# EAGLE design main (EAGLE 7.2.0)
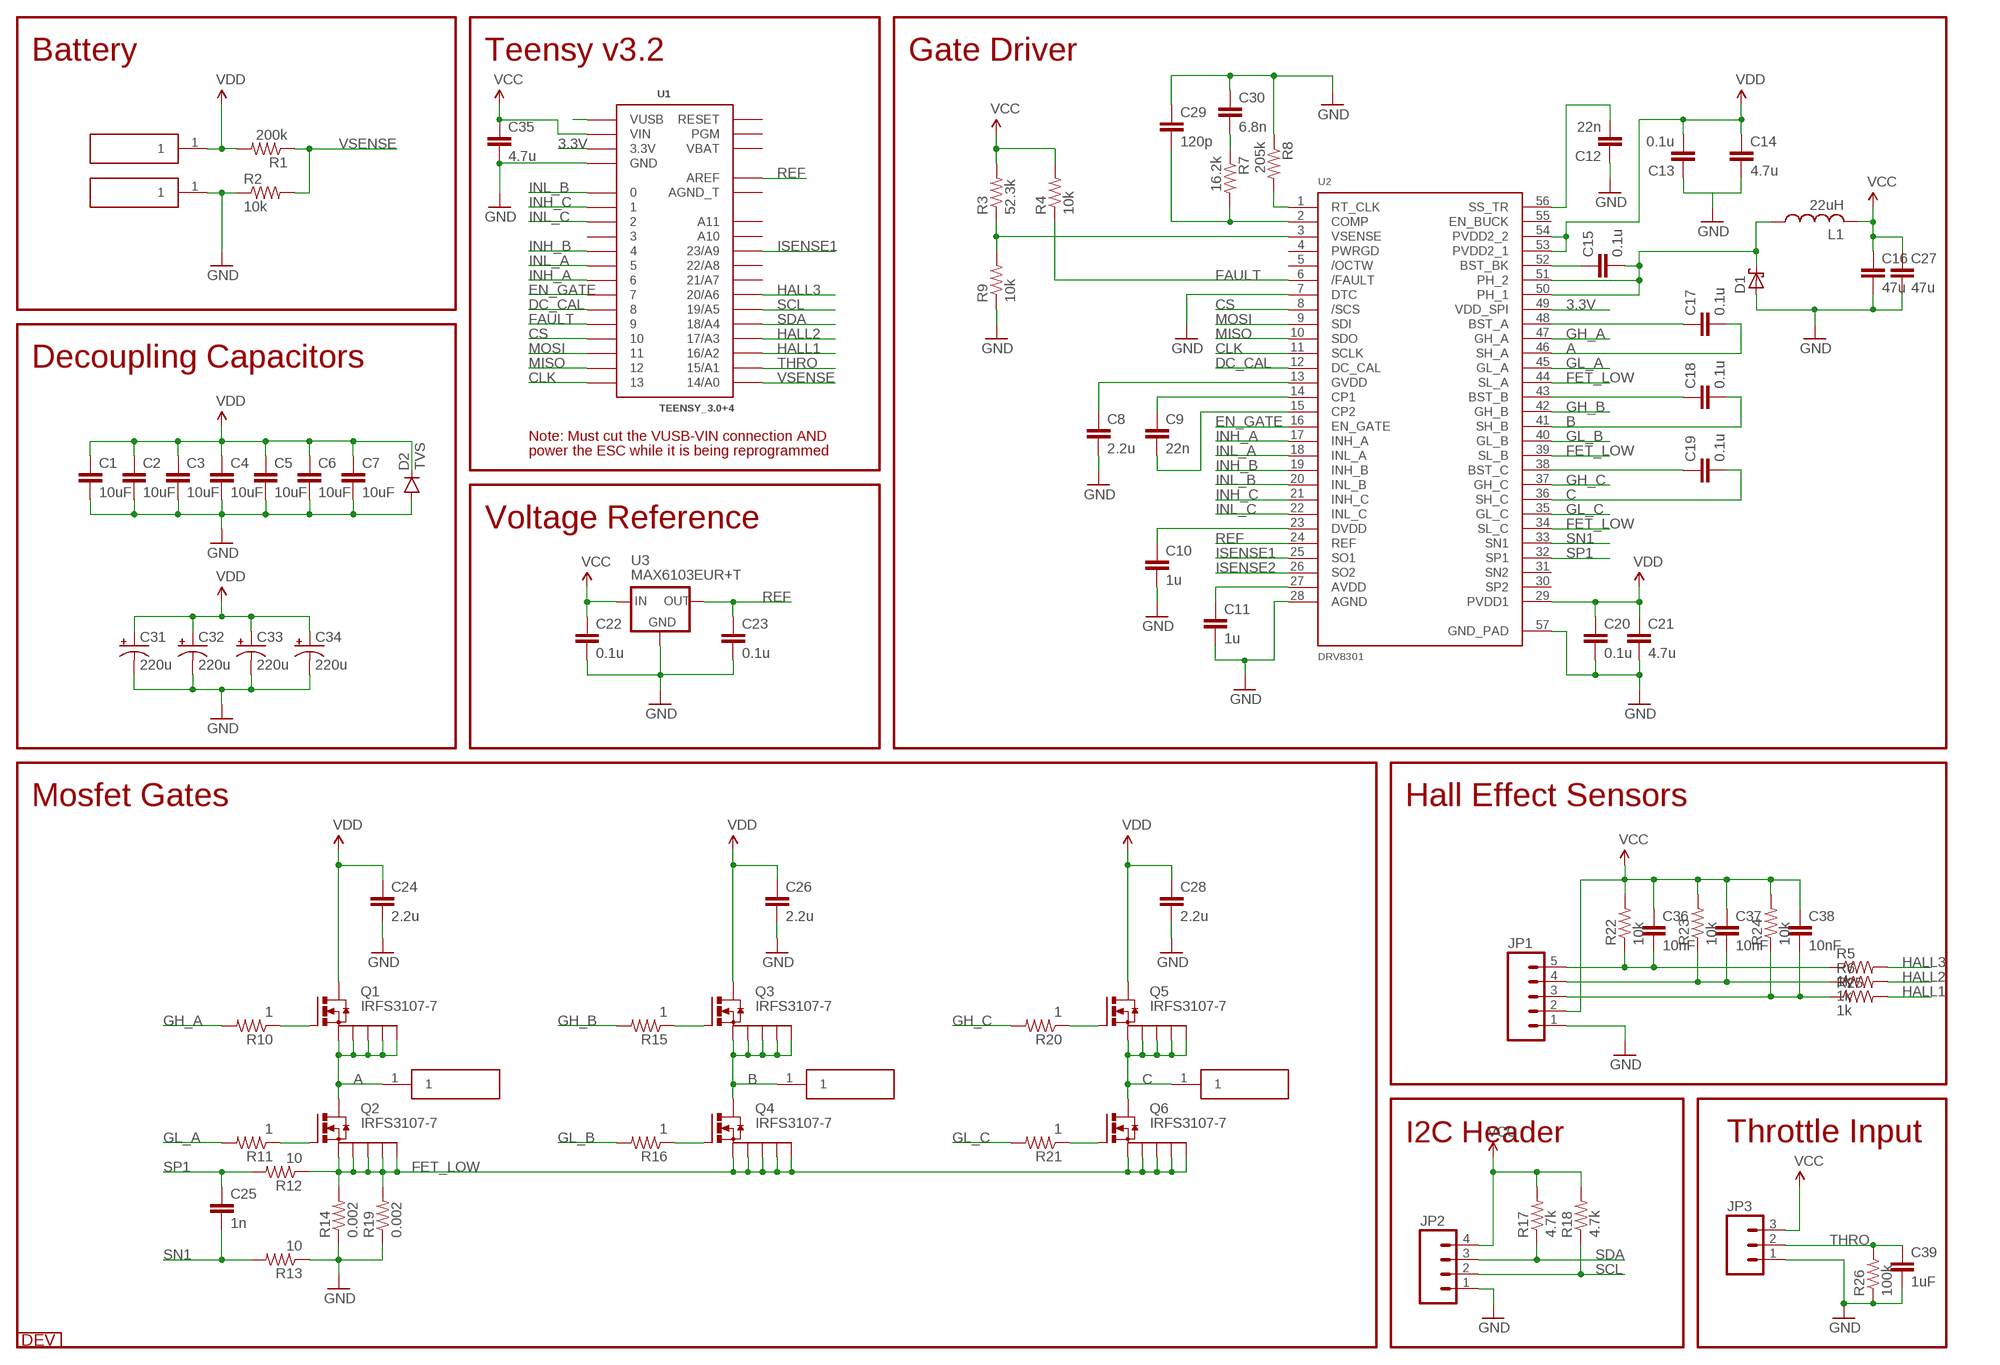
[diagram p0: schematic, sheet 1]

## Parts
C1  10uF  CAP1206  [1206]
C2  10uF  CAP1206  [1206]
C3  10uF  CAP1206  [1206]
C4  10uF  CAP1206  [1206]
C5  10uF  CAP1206  [1206]
C6  10uF  CAP1206  [1206]
C7  10uF  CAP1206  [1206]
C8  2.2u  CAP0603-CAP  [0603-CAP]
C9  22n  CAP0603-CAP  [0603-CAP]
C10  1u  CAP0603-CAP  [0603-CAP]
C11  1u  CAP0603-CAP  [0603-CAP]
C12  22n  CAP0603-CAP  [0603-CAP]
C13  0.1u  CAP0603-CAP  [0603-CAP]
C14  4.7u  CAP0805  [0805]
C15  0.1u  CAP0603-CAP  [0603-CAP]
C16  47u  CAP0805  [0805]
C17  0.1u  CAP0603-CAP  [0603-CAP]
C18  0.1u  CAP0603-CAP  [0603-CAP]
C19  0.1u  CAP0603-CAP  [0603-CAP]
C20  0.1u  CAP0603-CAP  [0603-CAP]
C21  4.7u  CAP0805  [0805]
C22  0.1u  CAP0603-CAP  [0603-CAP]
C23  0.1u  CAP0603-CAP  [0603-CAP]
C24  2.2u  CAP1206  [1206]
C25  1n  CAP0603-CAP  [0603-CAP]
C26  2.2u  CAP1206  [1206]
C27  47u  CAP0805  [0805]
C28  2.2u  CAP1206  [1206]
C29  120p  CAP0603-CAP  [0603-CAP]
C30  6.8n  CAP0603-CAP  [0603-CAP]
C31  220u  CPOL-USE3.5-8  [E3,5-8]
C32  220u  CPOL-USE3.5-8  [E3,5-8]
C33  220u  CPOL-USE3.5-8  [E3,5-8]
C34  220u  CPOL-USE3.5-8  [E3,5-8]
C35  4.7u  CAP0603-CAP  [0603-CAP]
C36  10nF  CAP0603-CAP  [0603-CAP]
C37  10nF  CAP0603-CAP  [0603-CAP]
C38  10nF  CAP0603-CAP  [0603-CAP]
C39  1uF  CAP0603-CAP  [0603-CAP]
D1  SCHOTTKY_SMA  [SMA]
D2  TVS  DIODEES3J  [SMC]
J1  0.125_PAD  [0.125_PAD]
J2  0.125_PAD  [0.125_PAD]
J3  0.125_PAD  [0.125_PAD]
J4  0.125_PAD  [0.125_PAD]
J5  0.125_PAD  [0.125_PAD]
JP1  M05PTH  [1X05]
JP2  M04PTH  [1X04]
JP3  M03PTH  [1X03]
L1  22uH  L-USL5650M  [L5650M]
Q1  IRFS3107-7  [D2PAK-7]
Q2  IRFS3107-7  [D2PAK-7]
Q3  IRFS3107-7  [D2PAK-7]
Q4  IRFS3107-7  [D2PAK-7]
Q5  IRFS3107-7  [D2PAK-7]
Q6  IRFS3107-7  [D2PAK-7]
R1  200k  RESISTOR0603  [0603-RES]
R2  10k  RESISTOR0603  [0603-RES]
R3  52.3k  RESISTOR0603  [0603-RES]
R4  10k  RESISTOR0603  [0603-RES]
R5  1k  RESISTOR0603-RES  [0603-RES]
R6  1k  RESISTOR0603-RES  [0603-RES]
R7  16.2k  RESISTOR0603  [0603-RES]
R8  205k  RESISTOR0603  [0603-RES]
R9  10k  RESISTOR0603  [0603-RES]
R10  1  RESISTOR0603  [0603-RES]
R11  1  RESISTOR0603  [0603-RES]
R12  10  RESISTOR0603  [0603-RES]
R13  10  RESISTOR0603  [0603-RES]
R14  0.002  RESISTOR2512  [R2512]
R15  1  RESISTOR0603  [0603-RES]
R16  1  RESISTOR0603  [0603-RES]
R17  4.7k  RESISTOR0603-RES  [0603-RES]
R18  4.7k  RESISTOR0603-RES  [0603-RES]
R19  0.002  RESISTOR2512  [R2512]
R20  1  RESISTOR0603  [0603-RES]
R21  1  RESISTOR0603  [0603-RES]
R22  10k  RESISTOR0603  [0603-RES]
R23  10k  RESISTOR0603  [0603-RES]
R24  10k  RESISTOR0603  [0603-RES]
R25  1k  RESISTOR0603-RES  [0603-RES]
R26  100k  RESISTOR0603-RES  [0603-RES]
U1  TEENSY_3.0+4  [TEENSY_3.0+4]
U2  DRV8301  [DRV8301]
U3  MAX6103EUR+T  [SOT23-3]
U$16  DEV  [DEV]

## Nets
3.3V: U1.3.3V U1.3.3V1(3.3V) U2.49(VDD_SPI)
A: C17.2 J3.1 Q1.S Q1.S1 Q1.S2 Q1.S3 Q1.S4 Q2.D U2.46(SH_A)
B: C18.2 J4.1 Q3.S Q3.S1 Q3.S2 Q3.S3 Q3.S4 Q4.D U2.41(SH_B)
C: C19.2 J5.1 Q5.S Q5.S1 Q5.S2 Q5.S3 Q5.S4 Q6.D U2.36(SH_C)
CLK: U1.13 U2.11(SCLK)
CS: U1.10 U2.8(/SCS)
DC_CAL: U1.8 U2.12(DC_CAL)
EN_GATE: U1.7 U2.16(EN_GATE)
FAULT: R4.1 U1.9 U2.6(/FAULT)
FET_LOW: Q2.S Q2.S1 Q2.S2 Q2.S3 Q2.S4 Q4.S Q4.S1 Q4.S2 Q4.S3 Q4.S4 Q6.S Q6.S1 Q6.S2 Q6.S3 Q6.S4 R12.1 R14.2 R19.2 U2.34(SL_C) U2.39(SL_B) U2.44(SL_A)
GH_A: R10.2 U2.47(GH_A)
GH_B: R15.2 U2.42(GH_B)
GH_C: R20.2 U2.37(GH_C)
GL_A: R11.2 U2.45(GL_A)
GL_A': Q2.G R11.1
GL_B: R16.2 U2.40(GL_B)
GL_B': Q4.G R16.1
GL_C: R21.2 U2.35(GL_C)
GL_C': Q6.G R21.1
GND: C1.2 C2.2 C3.2 C4.2 C5.2 C6.2 C7.2 C8.2 C10.2 C11.2 C12.1 C13.1 C14.2 C16.2 C20.2 C21.2 C22.2 C23.2 C24.2 C26.2 C27.2 C28.2 C29.1 C30.1 C31.- C32.- C33.- C34.- C35.2 C39.2 D1.A D2.A J2.1 JP1.1 JP2.1 JP3.1 R2.1 R8.1 R9.1 R13.1 R14.1 R19.1 R26.1 U1.GND U1.GND1(GND) U2.7(DTC) U2.28(AGND) U2.57(GND_PAD) U3.3(GND)
HALL1: R25.2 U1.16/A2
HALL2: R6.2 U1.17/A3
HALL3: R5.2 U1.20/A6
INH_A: U1.6 U2.17(INH_A)
INH_B: U1.4 U2.19(INH_B)
INH_C: U1.1 U2.21(INH_C)
INL_A: U1.5 U2.18(INL_A)
INL_B: U1.0 U2.20(INL_B)
INL_C: U1.2 U2.22(INL_C)
ISENSE1: U1.23/A9 U2.25(SO1)
ISENSE2: U2.26(SO2)
MISO: U1.12 U2.10(SDO)
MOSI: U1.11 U2.9(SDI)
N$1: Q3.G R15.1
N$2: R3.1 R9.2 U2.3(VSENSE)
N$3: C29.2 R7.2 U2.2(COMP)
N$4: C10.1 U2.23(DVDD)
N$5: Q5.G R20.1
N$6: C12.2 U2.56(SS_TR)
N$7: C30.2 R7.1
N$8: C15.1 U2.52(BST_BK)
N$9: Q1.G R10.1
N$10: R8.2 U2.1(RT_CLK)
N$12: U1.VUSB
N$13: C36.2 JP1.5 R5.1 R22.1
N$14: C37.2 JP1.4 R6.1 R23.1
N$15: C38.2 JP1.3 R24.1 R25.1
N$28: C19.1 U2.38(BST_C)
N$30: C9.1 U2.14(CP1)
N$31: C11.1 U2.27(AVDD)
N$32: C9.2 U2.15(CP2)
N$33: C8.1 U2.13(GVDD)
N$34: C18.1 U2.43(BST_B)
N$44: C17.1 U2.48(BST_A)
N$47: C15.2 D1.C L1.1 U2.50(PH_1) U2.51(PH_2)
REF: C23.1 U1.AREF U2.24(REF) U3.2(OUT)
SCL: JP2.2 R18.1 U1.19/A5
SDA: JP2.3 R17.1 U1.18/A4
SN1: C25.2 R13.2 U2.33(SN1)
SP1: C25.1 R12.2 U2.32(SP1)
THRO: C39.1 JP3.2 R26.2 U1.15/A1
VCC: C16.1 C22.1 C27.1 C35.1 C36.1 C37.1 C38.1 JP1.2 JP2.4 JP3.3 L1.2 R3.2 R4.2 R17.2 R18.2 R22.2 R23.2 R24.2 U1.VIN U3.1(IN)
VDD: C1.1 C2.1 C3.1 C4.1 C5.1 C6.1 C7.1 C13.2 C14.1 C20.1 C21.1 C24.1 C26.1 C28.1 C31.+ C32.+ C33.+ C34.+ D2.C J1.1 Q1.D Q3.D Q5.D R1.2 U2.29(PVDD1) U2.53(PVDD2_1) U2.54(PVDD2_2)
VSENSE: R1.1 R2.2 U1.14/A0
Unconnected: U1.3 U1.21/A7 U1.22/A8 U1.A10 U1.A11 U1.PGM U1.RESET U2.4(PWRGD) U2.5(/OCTW) U2.30(SP2) U2.31(SN2) U2.55(EN_BUCK)

## Notes on the sheet
- Battery | Teensy v3.2 | Gate Driver
- Decoupling Capacitors
- Note: Must cut the VUSB-VIN connection AND
- power the ESC while it is being reprogrammed
- Voltage Reference
- Mosfet Gates | Hall Effect Sensors
- I2C Header | Throttle Input

## Power pins joined to a net without a drawn wire
AGND_T: U1.AGND_T
VBAT: U1.VBAT

## Library data of the parts
C1-C30 C35 = SparkFun-Capacitors:CAP: Capacitor Standard 0603 ceramic capacitor, and 0.1" leaded capacitor.
C31-C34 = rcl:CPOL-US: POLARIZED CAPACITOR, American symbol
C36-C39 = SparkFun-Passives:CAP: Capacitor Standard 0603 ceramic capacitor, and 0.1" leaded capacitor.
D1 = sc_usercreated:SCHOTTKY_SMA
D2 = SparkFun-DiscreteSemi:DIODE: Diode These are standard reverse protection diodes and small signal diodes. SMA package can handle up to about 1A. SOD-323 can handle about 200mA. What the SOD-323 package when ordering, there are some mfgs out there that are 5-pin packages.; PROD_ID: DIO-12441; VALUE: 3A/600V
J1-J5 = sc_usercreated:0.125_PAD
JP1 = SparkFun-Connectors:M05: Header 5 Standard 5-pin 0.1" header. Use with straight break away headers (SKU : PRT-00116), right angle break away headers (PRT-00553), swiss pins (PRT-00743), machine pins (PRT-00117), and female headers (PRT-00115). Molex polarized connector foot print use with SKU : PRT-08230 with associated crimp pins and housings.
JP2 = SparkFun-Connectors:M04: Header 4 Standard 4-pin 0.1" header. Use with straight break away headers (SKU : PRT-00116), right angle break away headers (PRT-00553), swiss pins (PRT-00743), machine pins (PRT-00117), and female headers (PRT-00115). Molex polarized connector foot print use with SKU : PRT-08231 with associated crimp pins and housings. 1MM SMD Version SKU: PRT-10208
JP3 = SparkFun-Connectors:M03: Header 3 Standard 3-pin 0.1" header. Use with straight break away headers (SKU : PRT-00116), right angle break away headers (PRT-00553), swiss pins (PRT-00743), machine pins (PRT-00117), and female headers (PRT-00115). Molex polarized connector foot print use with SKU : PRT-08232 with associated crimp pins and housings.
L1 = rcl:L-US: INDUCTOR, American symbol
Q1-Q6 = sc_usercreated:IRFS3107-7
R1-R4 R7-R16 R19-R24 = SparkFun-Resistors:RESISTOR: Resistor Basic schematic elements and footprints for 0603, 1206, and PTH resistors.
R5 R6 R17 R18 R25 R26 = SparkFun-Passives:RESISTOR: Resistor Basic schematic elements and footprints for 0603, 1206, and PTH resistors.
U1 = Teensy3.0:TEENSY_3.0+4: Teensy 3.0 board, showing all pins that are easily acessible. See 'AllAnalogPins" and 'AllPins' packages for additional pin holes, as needed. The 'Basic' package has fewer pins.
U2 = F-J:DRV8301
U3 = F-J:MAX6103EUR+T
U$16 = F-J:DEV

## Board
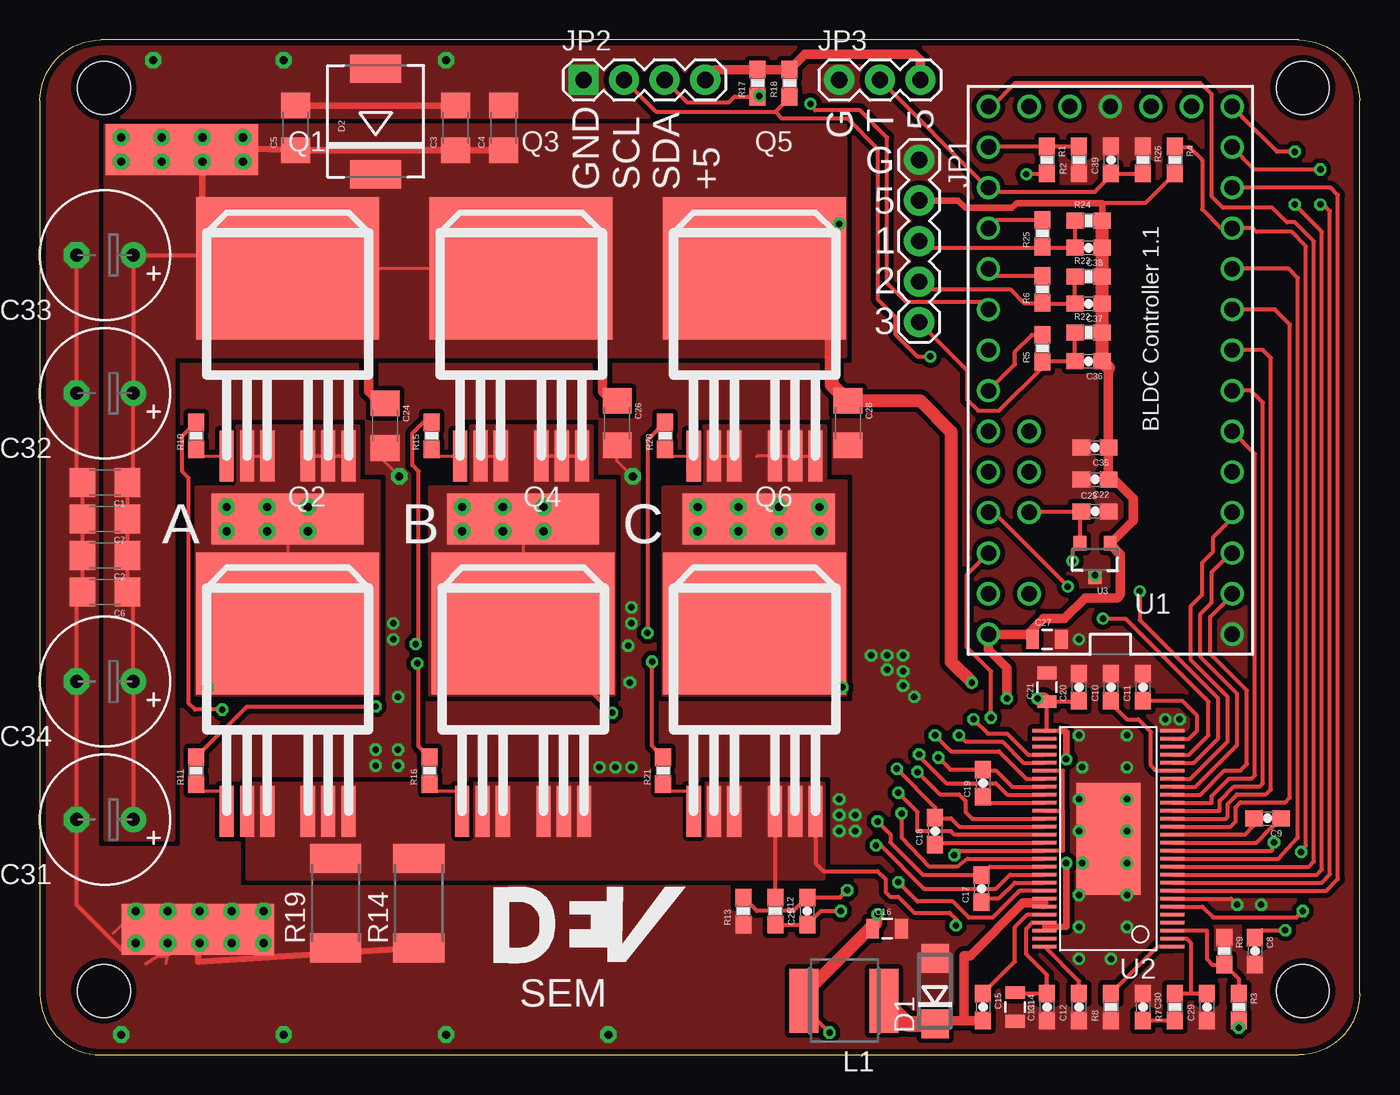
[diagram p1: board, top side]
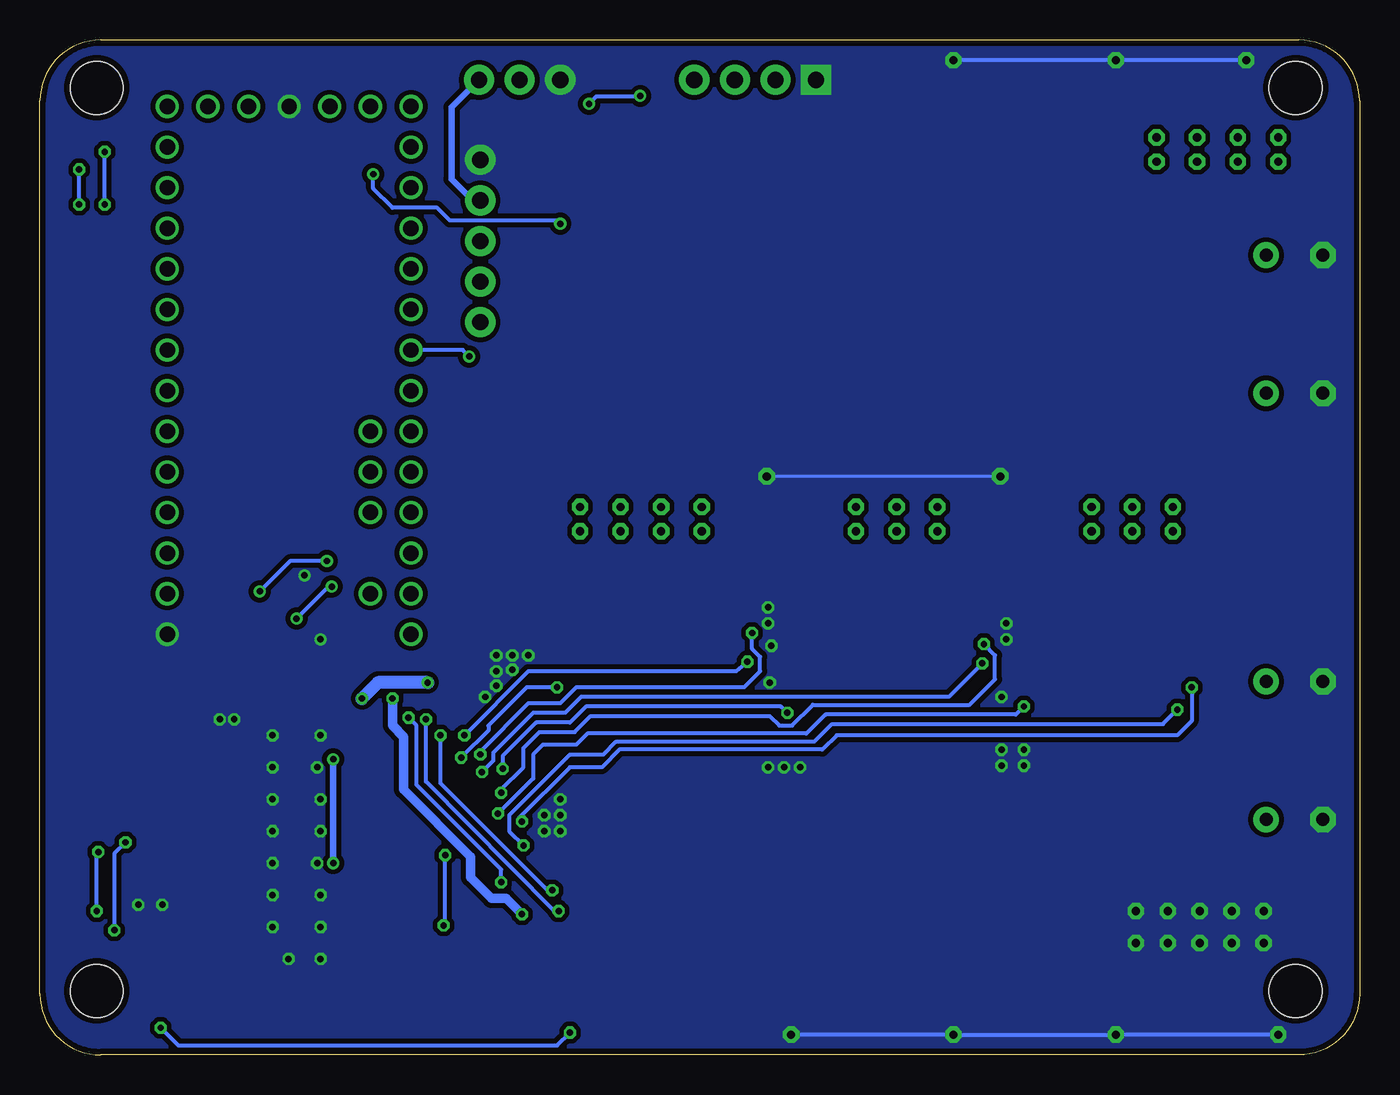
[diagram p2: board, bottom side, seen from below]

Size 82.55 x 63.5 mm. Coordinates in mm from the lower left corner, seen from the top.
Outline: 82.55,3.81 82.55,59.69 arc90 78.74,63.5 3.81,63.5 arc90 0,59.69 0,3.81 arc90 3.81,0 78.74,0 arc90 82.55,3.81
Copper layers (1*16): Top 0.0356mm / dielectric 1.5011mm / Bottom 0.0356mm
Design rules "patrick": minimum track width 6mil, minimum drill 13mil, track to track 6mil, track to pad 6mil, pad to pad 6mil, via to via 6mil, smd to smd 6mil, copper to edge 15mil, drill to drill 6mil, minimum pad ring 7mil, minimum via ring 7mil, stop-mask expansion 3mil, vias tented up to drill 30mil, thermal gap 10mil
Holes 3.3 mm at 4,60.5 79,60.5 4,4 79,4

### Footprints (pad centres in the part's own frame; a part is rotated, then mirrored left to right if it is on the bottom)
1206 = smd 1.6 x 1.8: 1 -1.4,0; 2 1.4,0
0603-CAP = smd 1.1 x 1: 1 -0.85,0; 2 0.85,0
0805 = smd 0.8 x 1.2: 1 -0.9,0; 2 0.9,0
E3,5-8 = drill 0.813 pad 1.6: + -1.778,0 | drill 0.813 pad 1.6 octagon: - 1.778,0
SMA = smd 1.8 x 1.7: A 2.05,0; C -2.05,0
SMC = smd 1.778 x 3.175: A 3.302,0; C -3.302,0
0.125_PAD = smd 9.525 x 3.175: 1 0,0
1X05 = drill 1.016 pad 1.88: 1 0,0; 2 2.54,0; 3 5.08,0; 4 7.62,0; 5 10.16,0
1X04 = drill 1.016 pad 1.88 square: 1 0,0 | drill 1.016 pad 1.88: 2 2.54,0; 3 5.08,0; 4 7.62,0
1X03 = drill 1.016 pad 1.88: 1 0,0; 2 2.54,0; 3 5.08,0
L5650M = smd 1.8 x 4: 1 -2.5,0; 2 2.5,0
D2PAK-7 = smd 11.43 x 8.89: D 0,11.748 | smd 0.889 x 3.175: G -3.81,0; S -2.54,0; S1 -1.27,0; S2 1.27,0; S3 2.54,0; S4 3.81,0
0603-RES = smd 1.1 x 1: 1 -0.85,0; 2 0.85,0
R2512 = smd 1.8 x 3.2: 1 -2.8,0; 2 2.8,0
TEENSY_3.0+4 = drill 0.965: 0 -7.62,13.97; 1 -7.62,11.43; 2 -7.62,8.89; 3 -7.62,6.35; 3.3V 7.62,11.43; 3.3V1 -2.54,-16.51; 4 -7.62,3.81; 5 -7.62,1.27; 6 -7.62,-1.27; 7 -7.62,-3.81; 8 -7.62,-6.35; 9 -7.62,-8.89; 10 -7.62,-11.43; 11 -7.62,-13.97; 12 -7.62,-16.51; 13 7.62,-16.51; 14/A0 7.62,-13.97; 15/A1 7.62,-11.43; 16/A2 7.62,-8.89; 17/A3 7.62,-6.35; 18/A4 7.62,-3.81; 19/A5 7.62,-1.27; 20/A6 7.62,1.27; 21/A7 7.62,3.81; 22/A8 7.62,6.35; 23/A9 7.62,8.89; A10 5.08,6.35; A11 5.08,3.81; AGND_T 7.62,13.97; AREF 5.08,8.89; GND -7.62,16.51; GND1 0,-16.51; PGM 2.54,-16.51; RESET 5.08,-16.51; VBAT -5.08,-16.51; VIN 7.62,16.51; VUSB 5.08,13.97
DRV8301 = smd 1.5 x 0.21: 1 -4,6.75; 2 -4,6.25; 3 -4,5.75; 4 -4,5.25; 5 -4,4.75; 6 -4,4.25; 7 -4,3.75; 8 -4,3.25; 9 -4,2.75; 10 -4,2.25; 11 -4,1.75; 12 -4,1.25; 13 -4,0.75; 14 -4,0.25; 15 -4,-0.25; 16 -4,-0.75; 17 -4,-1.25; 18 -4,-1.75; 19 -4,-2.25; 20 -4,-2.75; 21 -4,-3.25; 22 -4,-3.75; 23 -4,-4.25; 24 -4,-4.75; 25 -4,-5.25; 26 -4,-5.75; 27 -4,-6.25; 28 -4,-6.75; 29 4,-6.75; 30 4,-6.25; 31 4,-5.75; 32 4,-5.25; 33 4,-4.75; 34 4,-4.25; 35 4,-3.75; 36 4,-3.25; 37 4,-2.75; 38 4,-2.25; 39 4,-1.75; 40 4,-1.25; 41 4,-0.75; 42 4,-0.25; 43 4,0.25; 44 4,0.75; 45 4,1.25; 46 4,1.75; 47 4,2.25; 48 4,2.75; 49 4,3.25; 50 4,3.75; 51 4,4.25; 52 4,4.75; 53 4,5.25; 54 4,5.75; 55 4,6.25; 56 4,6.75 | smd 4 x 7: 57 0,0
SOT23-3 = smd 0.8 x 0.9: 1 -0.95,-1; 2 0.95,-1; 3 0,1.1

### Placement (x,y rotation side)
C1  4.06,35.81 180 top
C2  4.06,31.24 180 top
C3  26,58 90 top
C4  29,58 90 top
C5  16,58 90 top
C6  4.06,28.96 180 top
C7  4.06,33.53 180 top
C8  76,6.5 270 top
C9  76.8,14.8 180 top
C10  67,23 90 top
C11  69,23 90 top
C12  65,3 90 top
C13  63,3 90 top
C14  61,3 270 top
C15  59,3 270 top
C16  53,7.9 0 top
C17  58.9,10.4 90 top
C18  56,14 90 top
C19  59,17 90 top
C20  65,23 90 top
C21  63,23 90 top
C22  66,36 180 top
C23  66,34 0 top
C24  21.59,39.37 270 top
C25  48,9 90 top
C26  36.11,39.53 270 top
C27  63,26 0 top
C28  50.55,39.53 270 top
C29  73,3 90 top
C30  69,3 270 top
C31  4.06,14.73 180 top
C32  4.06,41.4 180 top
C33  4.06,50.04 180 top
C34  4.06,23.37 180 top
C35  66,38 180 top
C36  65.6,43.4 180 top
C37  65.6,47 180 top
C38  65.6,50.5 180 top
C39  67,56 90 top
D1  56,4 90 top
D2  21,58.4 90 top
J1  8.89,56.64 0 top
J2  9.89,7.86 0 top
J3  15.49,33.53 0 top
J4  30.23,33.53 0 top
J5  44.96,33.53 0 top
JP1  55,56 270 top
JP2  34,61 0 top
JP3  50,61 0 top
L1  50.3,3.4 180 top
Q1  15.49,37.47 0 top
Q2  15.49,15.24 0 top
Q3  30.1,37.47 0 top
Q4  30.23,15.24 0 top
Q5  44.7,37.47 0 top
Q6  44.7,15.24 0 top
R1  63,56 270 top
R2  65,56 90 top
R3  75,3 270 top
R4  71,56 270 top
R5  62.7,44.2 90 top
R6  62.7,47.9 90 top
R7  71,3 90 top
R8  67,3 90 top
R9  74.1,6.5 270 top
R10  9.78,38.73 90 top
R11  9.78,17.78 90 top
R12  46,9 270 top
R13  44,9 90 top
R14  23.7,9.5 90 top
R15  24.51,38.73 90 top
R16  24.38,17.78 90 top
R17  44.9,60.8 90 top
R18  46.9,60.8 90 top
R19  18.5,9.5 90 top
R20  39.12,38.73 90 top
R21  38.99,17.78 90 top
R22  65.6,45.2 0 top
R23  65.6,48.7 0 top
R24  65.6,52.2 0 top
R25  62.7,51.4 90 top
R26  69,56 270 top
U1  66.96,42.83 180 top
U2  66.83,13.53 180 top
U3  66,31 180 top
U$16  28.4,5.77 0 top

### Tracks (layer width: path | path; a pad name or v marks a point on that pad's centre or on a via)
3.3V  (via drill 0.4)
  Top 0.254: U2.49 61.28,10.28 59.6,8.6 58.1,8.6 57.1,9.6 54.9,9.6 v53.7,10.8 | v59.5,21.1 59.5,24 58,25.5 58,30.06 U1.3.3V
  Bottom 0.254: v53.7,10.8 53.7,11.6 59,16.9 59,20.6 v59.5,21.1
A  (via drill 0.4, 0.51 pad 1.02)
  Top 0.203: Q1.S Q1.S1 | J3.1 Q2.D | Q1.S2 Q1.S3 Q1.S4 Q1.S2
  Top 0.254: U2.46 59.43,11.78 C17.2 55.25,11.25 53.2,13.3 53.2,13.8 v52.4,14.6 | Q2.D 14.49,26.99 v10.5,23
  Bottom 0.254: v10.5,23 10.5,20.9 11.4,20 32.7,20 33.6,19.1 46.3,19.1 47.4,18 49.4,18 52.6,14.8 v52.4,14.6
  other vias: 11.68,34.29 11.68,32.77 14.22,34.29 14.22,32.77 16.76,34.29 16.76,32.77
  pour Top (no thermals): 9.78,22.48 9.78,35.56 12.32,35.56 12.32,39.37 19.94,39.37 19.94,35.94 21.21,35.94 21.21,22.48
B  (via drill 0.4, 0.51 pad 1.02)
  Top 0.203: Q3.S Q3.S1 | J4.1 Q4.D | Q3.S2 Q3.S3 Q3.S4 Q3.S2
  Top 0.254: Q4.D 35.8,21.41 v35.8,21.4 | v53.6,17.9 56,15.5 C18.2 56.05,14.8 57,14.8 57.52,14.28 U2.41
  Bottom 0.254: v35.8,21.4 36.2,21.8 48.4,21.8 49.4,20.8 51.5,20.8 53.6,18.7 v53.6,17.9
  other vias: 26.42,34.29 26.42,32.77 28.96,34.29 28.96,32.77 31.5,34.29 31.5,32.77
  pour Top (no thermals): 24.38,22.48 24.38,35.56 26.92,35.56 26.92,39.37 34.54,39.37 34.54,35.94 35.94,35.94 35.94,22.48
C  (via drill 0.4, 0.51 pad 1.02)
  Top 0.203: Q5.S Q5.S1 | Q5.S4 Q5.S3 Q5.S2 44.83,37.47 | v48.77,32.77 v48.77,34.29
  Top 0.254: Q6.D 48.69,23 v50.2,23 | v56.2,18.6 56.95,17.85 C19.2 59.05,17.8 59.8,17.8 60.82,16.78 U2.36
  Bottom 0.254: v50.2,23 52.1,23 54.5,20.6 54.5,20.3 v56.2,18.6
  other vias: 41.15,34.29 41.15,32.77 43.69,32.77 43.69,34.29 46.23,34.29 46.23,32.77
  pour Top (no thermals): 38.99,22.48 38.99,35.56 41.53,35.56 41.53,39.37 49.15,39.37 49.15,35.94 50.42,35.94 50.42,22.48
CLK
  Top 0.254: U2.11 79.38,11.78 79.7,12.1 79.7,50.9 78.5,52.1 78,52.1 77.1,53 74,53 73.3,53.7 73.3,60.1 72.6,60.8 61,60.8 59.54,59.34 U1.13
CS
  Top 0.254: U2.8 80.48,10.28 81.2,11 81.2,53.8 80.74,54.26 U1.10
DC_CAL
  Top 0.254: U2.12 77.48,12.28 78.7,13.6 78.7,48.6 78.12,49.18 U1.8
EN_GATE
  Top 0.254: U1.7 77.26,46.64 78.2,45.7 78.2,16.1 77.9,15.8 75.1,15.8 74.8,15.5 74.8,14.6 74.48,14.28 U2.16
FAULT  (via drill 0.4)
  Top 0.254: v78.9,12.7 79.2,13.1 79.2,50.6 78.3,51.5 76.1,51.5 75.88,51.72 U1.9 73.88,51.72 72.7,52.9 72.7,56 71.9,56.8 71.05,56.8 R4.1 | U2.6 72.72,9.28 73.4,8.6 78.6,8.6 v79,9
  Bottom 0.254: v79,9 79,12.3 v78.9,12.7
FET_LOW  (via drill 0.4)
  Top 0.203: 19.3,13.97 Q2.S4
  Top 0.254: R12.1 46,15.21 Q6.S2 | 64,15.28 64,17.78 U2.34 | U2.39 64,15.28 | 64,15.28 64,12.78 U2.44 57.48,12.78 v57.2,12.5 | Q6.S4 48.51,12 49.01,11.5 52.4,11.5 52.9,11 52.9,10.2 53.2,9.9 53.7,9.9 54.7,8.9 56.9,8.9 57.3,8.5 v57.3,8.1
  Bottom 0.254: v57.3,8.1 57.2,8.2 v57.2,12.5
  pour Top (isolate 0.254, no thermals): 13,11 13,17 49,17 49,11
GH_A  (via drill 0.4)
  Top 0.254: v11.4,21.6 9.7,21.6 9.3,22 9.3,36.1 8.9,36.5 8.9,38.71 R10.2 | v52.3,13.1 52.6,13.1 55.3,10.4 59.8,10.4 60.68,11.28 U2.47
  Bottom 0.254: v11.4,21.6 12.3,20.7 33,20.7 34.1,19.6 46.5,19.6 47.3,18.8 49.4,18.8 53.2,15 53.2,14 v52.3,13.1
GH_B  (via drill 0.4)
  Top 0.254: U2.42 57.22,13.78 57,14 54.9,14 54.9,15.2 v53.7,16.4 | R15.2 23.98,39.59 23.3,38.9 23.3,36.9 23.7,36.5 23.7,25.9 v23.5,25.7
  Bottom 0.254: v53.7,16.4 53.7,16.6 52.3,18 52.3,19.2 51.3,20.2 49.1,20.2 48.1,21.2 36.9,21.2 36.3,20.6 35.5,20.6 34.2,21.9 24.4,21.9 22.8,23.5 22.8,25 v23.5,25.7
GH_C  (via drill 0.4)
  Top 0.254: R20.2 38,38.47 v38,26.4 | v55,18.8 55,18.7 56.7,17 59.8,17 60.52,16.28 U2.37
  Bottom 0.254: v55,18.8 55,19 52,22 50,22 49,23 38.5,23 37.5,24 37.5,24.9 38,25.4 v38,26.4
GL_A  (via drill 0.4)
  Top 0.254: R11.2 12.95,21.8 v21,21.8 | v53.9,15.1 53.9,13.6 55.6,11.8 57.44,11.8 58.02,12.28 U2.45
  Bottom 0.254: v21,21.8 21.5,21.3 33.4,21.3 34.6,20.1 48.3,20.1 49,19.4 51.1,19.4 51.7,18.8 51.7,17.3 v53.9,15.1
GL_A'
  Top 0.203: R11.1 9.56,16.51 11.68,16.51 Q2.G
GL_B  (via drill 0.4)
  Top 0.254: R16.2 23.7,19.31 23.7,24.4 v23.6,24.5 | v54.9,17.7 56.3,16.3 57.5,16.3 57.9,15.9 57.9,15.2 58.32,14.78 U2.40
  Bottom 0.254: v23.6,24.5 25.7,22.4 48.7,22.4 49.7,21.4 51.7,21.4 54.2,18.9 54.2,18.4 v54.9,17.7
GL_B'
  Top 0.203: R16.1 24.17,16.51 26.29,16.51 Q4.G
GL_C  (via drill 0.4)
  Top 0.254: R21.2 38.3,19.32 v38.3,24.6 | v56,20 57,19 60,19 61.72,17.28 U2.35
  Bottom 0.254: v38.3,24.6 39,24 52,24 v56,20
GL_C'
  Top 0.203: R21.1 38.77,16.51 40.89,16.51 Q6.G
GND  (via drill 0.4, 0.51 pad 1.02)
  Top 0.203: J2.1 7.97,6.18 | 7.97,6.18 7.87,5.71 | 6.6,5.71 7.15,6.04 | 7.15,6.04 J2.1 | 7.41,6.18 7.97,6.18 | 6.6,6.99 6.86,6.99 | 6.86,6.99 J2.1 | 9.02,6.35 J2.1 | 4.57,7.62 v6,9 | v6,9 v10,9 | v10,9 v12,9 | v14,7 v12,7 v10,7 7.29,6.1 arc45 7.15,6.04 | v6,7 5.08,6.6 v6,9 | v14,7 v14,9 | 12.7,6.35 v14,7 | v10,9 7.37,7.76 arc-45 7.18,7.31 6.86,6.99 | v22.48,36.2 21.59,37.08 C24.2 | v37.08,36.2 36.11,37.17 C26.2
  Top 0.254: 2.66,35.31 C7.2 C2.2 C6.2 2.29,28.58 C34.- C31.- 2.29,9.4 5.08,6.6 | 2.66,35.31 C1.2 2.29,36.19 C32.- C33.- | 2.29,35.68 2.66,35.31 | U2.7 74.52,9.78 v74.9,9.4
  Top 0.406: R14.1 9.91,5.84 J2.1 | C3.2 C5.2
  Bottom 0.203: v22.48,36.2 v37.08,36.2
  Bottom 0.254: v5.08,1.27 v15.24,1.27 v25.4,1.27 v35.56,1.27 | v7.08,62.23 v15.24,62.23 v25.4,62.23
  other vias: 76.4,9.4 71.3,21 70.4,21 67,6 65,6 65,8 68,8 65,10 68,10 68,12 65.2,12 65,14 65,16 68,14 68,16 68,18 65,20 65.2,18 68,20 22.1,27 22.1,26 22.4,22.4 22.4,19.1 21,19.1 21,18.1 22.4,18.1 35,18 36,18 37,18 36.9,23.3 36.8,25.6 37,27 37,28 52,25 53,25 54,25 54,24 53,24.1 54,23.1 54.7,22.4 50,16 50,15 50,14 51,15 51,14 8,9 8,7 66,30 65,26
  pour Bottom (isolate 0.305, rank 2, no thermals): 3.81,-5.08 78.74,-5.08 arc90 87.63,3.81 87.63,59.69 arc90 78.74,68.58 3.81,68.58 arc90 -5.08,59.69 -5.08,3.81 arc90
  pour Top (isolate 0.305, rank 2, no thermals): -2.54,3.81 arc90 3.81,-2.54 78.74,-2.54 arc90 85.09,3.81 85.09,59.69 arc90 78.74,66.04 3.81,66.04 arc90 -2.54,59.69
HALL1
  Top 0.254: U1.16/A2 59.87,52.25 R25.2
HALL2
  Top 0.254: U1.17/A3 59.77,48.75 R6.2
HALL3
  Top 0.254: U1.20/A6 61,43.22 61,44 62.05,45.05 R5.2
INH_A
  Top 0.254: U1.6 76.5,44.1 77,43.6 77,16.6 76.7,16.3 74.9,16.3 74.3,15.7 74.3,14.9 74.18,14.78 U2.17
INH_B
  Top 0.254: U1.4 76,37.6 76,17.5 75.8,17.3 74.4,17.3 73.3,16.2 73.3,15.8 73.28,15.78 U2.19
INH_C
  Top 0.254: U2.21 72.28,16.78 74.9,19.4 74.9,22.6 72.6,24.9 72.6,27.6 73.3,28.3 73.3,30.2 74.5,31.4 U1.1
INL_A
  Top 0.254: U1.5 75.74,41.56 76.5,40.8 76.5,17 76.3,16.8 74.7,16.8 73.8,15.9 73.8,15.3 73.78,15.28 U2.18
INL_B
  Top 0.254: U2.20 72.58,16.28 74.1,17.8 75.1,17.8 75.5,18.2 75.5,22.8 73.2,25.1 73.2,27.4 74.58,28.78 U1.0
INL_C
  Top 0.254: U2.22 71.98,17.28 74.3,19.6 74.3,22.4 72,24.7 72,28.1 72.7,28.8 72.7,30.8 73.4,31.5 73.4,32.4 74.58,33.58 U1.2
ISENSE1  (via drill 0.4)
  Top 0.254: U2.25 71.88,18.78 73.1,20 73.1,22.1 67.9,27.3 v66.5,27.3 | U1.23/A9 59.66,33.94 v64.3,29.3
  Bottom 0.254: v64.3,29.3 64.5,29.3 v66.5,27.3
MISO  (via drill 0.4)
  Top 0.254: U2.10 79.88,11.28 80.2,11.6 80.2,51.5 v78.5,53.2 | v78.5,56.5 77.4,56.5 75.2,58.7 75.2,58.72 U1.12
  Bottom 0.254: v78.5,53.2 v78.5,56.5
MOSI  (via drill 0.4)
  Top 0.254: U2.9 80.18,10.78 80.7,11.3 80.7,52.8 80.3,53.2 v80.1,53.2 | v80.1,55.4 75.98,55.4 U1.11
  Bottom 0.254: v80.1,53.2 v80.1,55.4
N$1
  Top 0.203: R15.1 24.8,37.47 Q3.G
N$2
  Top 0.254: U2.3 73,7.78 73,6 73.35,5.65 R9.2 75,4.75 R3.1
N$3
  Top 0.254: R7.2 72,3.85 | 72,3.85 C29.2 | U2.2 71.72,7.28 72,7 72,3.85
N$4
  Top 0.254: U2.23 69.82,17.78 69.5,18.1 69.5,20.2 68.7,21 68,21 67,22 C10.1
N$5
  Top 0.203: R20.1 39.41,37.47 Q5.G
N$6
  Top 0.254: C12.2 65,4.61 U2.56
N$7
  Top 0.254: R7.1 C30.2
N$8
  Top 0.254: C15.1 61,5.85 61,8 61.78,8.78 U2.52
N$9
  Top 0.203: R10.1 10.2,37.47 Q1.G
N$10
  Top 0.254: R8.2 69.93,6.78 U2.1
N$13
  Top 0.254: R22.1 C36.2 62.75,43.4 R5.1 62.7,43 60,40.3 58.7,40.3 58,41 58,42.84 JP1.5
N$14
  Top 0.254: R23.1 C37.2 62.75,47 R6.1 61.55,47.05 60.7,47.9 55.48,47.9 JP1.4
N$15
  Top 0.254: R24.1 C38.2 62.75,50.5 R25.1 62.7,50.5 55.42,50.5 JP1.3
N$28
  Top 0.254: C19.1 59.37,15.78 U2.38
N$30
  Top 0.254: U2.14 76.08,13.28 77,14.2 77.05,14.2 C9.1
N$31
  Top 0.254: U2.27 71.88,19.78 72.4,20.3 72.4,21.2 71.45,22.15 C11.1
N$32
  Top 0.254: C9.2 75.95,14.35 75.38,13.78 U2.15
N$33  (via drill 0.4)
  Top 0.254: U2.13 77.08,12.78 77.1,12.8 77.1,13.2 v77.2,13.3 | C8.1 76.45,7.8 v77.9,7.8
  Bottom 0.254: v77.2,13.3 77.9,12.6 v77.9,7.8
N$34
  Top 0.254: C18.1 56.13,13.28 U2.43
N$44
  Top 0.254: C17.1 59.15,9.8 60,9.8 60.98,10.78 U2.48
N$47
  Top 0.254: U2.50 U2.51 62.62,9.28 62.8,9.5
  Top 0.61: D1.C 56.2,2.15 C15.2 57.8,2.15 57.8,6.2 58.2,6.2 61.5,9.5 62.8,9.5
  Top 1.016: L1.1 54.25,1.95 D1.C
REF  (via drill 0.4)
  Top 0.254: U2.24 72.18,18.28 73.7,19.8 73.7,22.3 68.8,27.2 v68.8,29 | U1.AREF 61.94,34 C23.1 65.05,33.9 U3.2 64.6,31.55 v64.6,30.9
  Bottom 0.254: v64.6,30.9 66.9,30.9 v68.8,29
SCL  (via drill 0.4)
  Top 0.254: JP2.2 38.54,59 46,59 | 46,59 46.9,59.9 R18.1 | 46,59 46.4,58.6 50.5,58.6 52.4,56.7 52.4,47.3 53.5,46.2 53.5,45.1 54.9,43.7 v55.7,43.7
  Bottom 0.254: v55.7,43.7 56.1,44.1 U1.19/A5
SDA  (via drill 0.4)
  Top 0.254: JP2.3 40.48,59.6 43.1,59.6 43.45,59.95 R17.1 44.95,60 v45,60 | U1.18/A4 58.88,47.1 54.2,47.1 53,48.3 53,57.4 51.3,59.1 48.5,59.1 48.2,59.4 v48.2,59.5
  Bottom 0.254: v48.2,59.5 47.75,59.95 45.05,59.95 v45,60
SN1  (via drill 0.4)
  Top 0.254: R13.2 44.85,9 47.15,9 C25.2 50.05,9.85 v50.5,10.3 | v57.5,20 57.9,19.6 60.2,19.6 61.52,18.28 U2.33
  Bottom 0.254: v50.5,10.3 50.8,10.3 57.5,17 v57.5,20
SP1  (via drill 0.4)
  Top 0.254: R12.2 C25.1 48.85,9 v50.1,9 | v58.4,21 59.3,20.1 60.5,20.1 61.82,18.78 U2.32
  Bottom 0.254: v50.1,9 50.4,9 58.4,17.1 v58.4,21
THRO
  Top 0.254: R26.2 C39.1 67,55 66,54 59.6,54 U1.15/A1 59.28,54.26 JP3.2
VCC  (via drill 0.4)
  Top 0.254: R3.2 v75,1.7 | v49.4,1.4 47.8,3 L1.2 | R4.2 69.15,53.3 66.45,53.3
  Top 0.406: R24.2 66.45,53.3 61.1,53.3 60.8,53 57.9,53 57.44,53.46 JP1.2
  Top 0.61: L1.2 47.8,3.8 | C16.1 52.4,8.2 v52.4,8.8 | v60.5,22.3 60.5,24.2 59.34,25.36 U1.VIN 61.78,26.32 | C27.1 61.78,26.32 | JP2.4 42.27,61.65 R17.2 R18.2 47.85,62.6 54.7,62.6 55.08,62.22 JP3.3 | C22.1 67.2,36 68.4,34.8 68.4,33.45 U3.1 66.95,31.95 67.6,31.3 67.6,28.8 67.4,28.6 65.4,28.6 64.1,27.3 62.76,27.3 61.78,26.32 | C22.1 C35.1 | C22.1 66.85,43
  Top 0.813: 47.8,3.8 51.9,7.9 C16.1 | R24.2 C38.1 R23.2 C37.1 R22.2 C36.1 66.85,43
  Bottom 0.254: v75,1.7 73.9,0.6 50.2,0.6 v49.4,1.4
  Bottom 0.406: JP3.3 56.8,59.28 56.8,54.8 55.46,53.46 JP1.2
  Bottom 0.61: v52.4,8.8 53.4,9.8 54.3,9.8 55.6,11.1 55.6,12.4 59.8,16.6 59.8,19.9 60.5,20.6 v60.5,22.3
VDD  (via drill 0.4, 0.51 pad 1.02)
  Top 0.203: Q1.D Q3.D 31.05,49.21 35.18,45.09 | Q1.D 16.45,49.21 20.57,45.09 | 13.27,46.99 Q1.D | 8.64,56.39 J1.1 | 44.7,50.55 Q5.D 46.67,49.21 46.99,48.9 50.16,45.72 | v7.62,55.88 v5.08,55.88 v5.08,57.4 | v7.62,55.88 v10.16,55.88 | v10.16,57.4 v12.7,57.4 v12.7,55.88 12.95,55.63 | v10.16,57.4 8.64,57.66 | 8.64,57.66 v7.62,57.4 | v7.62,55.88 7.62,56.13 8.64,57.15 8.64,57.66 | Q1.D 15.49,49.78 14.99,49.78 13.97,49.78 13.72,49.78 9.91,53.59 | v10.16,57.4 9.91,57.66
  Top 0.254: 14.99,49.78 14.73,50.04 C33.+ C32.+ 5.84,36.19 C1.1 C7.1 | C7.1 5.46,33.14 5.59,33.02 5.59,33.4 C7.1 | C7.1 C2.1 C6.1 5.84,28.58 C34.+ C31.+ | C14.1 61.05,3.85 C13.2 63,5 61.7,6.3 61.7,7.9 62.08,8.28 U2.53 U2.54 63,7.78 63,8 | C20.1 65,22.1 C21.1 63,20.28 U2.29 63.48,20.28 63.8,20.3 | 50.16,45.72 50,45.88 v50,52 | v61.7,55.1 61.75,55.15 R1.2 | 50.51,40.93 C28.1
  Top 0.406: J1.1 8.64,56.9 8.64,57.15 11.43,57.15 11.81,56.77 C5.1 C3.1 C4.1 | v10.16,55.88 10.16,52.07 13.97,52.07 13.97,49.78 | 63.8,20.3 64.2,20.2 v64.2,18.5 | v64.2,12 64.2,8 63,8
  Top 0.61: 20.57,45.09 20.57,41.49 21.29,40.77 C24.1 | 35.18,45.09 35.18,41.49 35.74,40.93 C26.1 | 50.51,40.93 50.16,41.27
  Top 0.813: C28.1 55.07,40.93 57,39 57,24.6 v58.3,23.3 | v62.4,22.3 62.8,22.3 C21.1
  Top 0.889: 50.16,41.27 49.53,41.91 49.53,45.09 46.99,47.62 46.99,48.9
  Top 0.914: 50.16,41.11 50.16,41.27
  Bottom 0.254: v50,52 50.2,52.2 56.9,52.2 57.7,53 60.5,53 61.7,54.2 v61.7,55.1
  Bottom 0.406: v64.2,18.5 v64.2,12
  Bottom 0.813: v58.3,23.3 61.4,23.3 v62.4,22.3
  pour Top (no thermals): 4.06,58.17 4.06,13.46 8.38,13.46 8.38,43.69 50.42,43.69 50.42,58.17
VSENSE
  Top 0.254: U1.14/A0 59.39,56.85 R1.1 R2.2

### Text on the board
tPlace: G / T / 5 | GND / SCL / SDA / +5 | G / 5 / 1 / 2 / 3 | BLDC Controller 1.1 | A | B | C | SEM